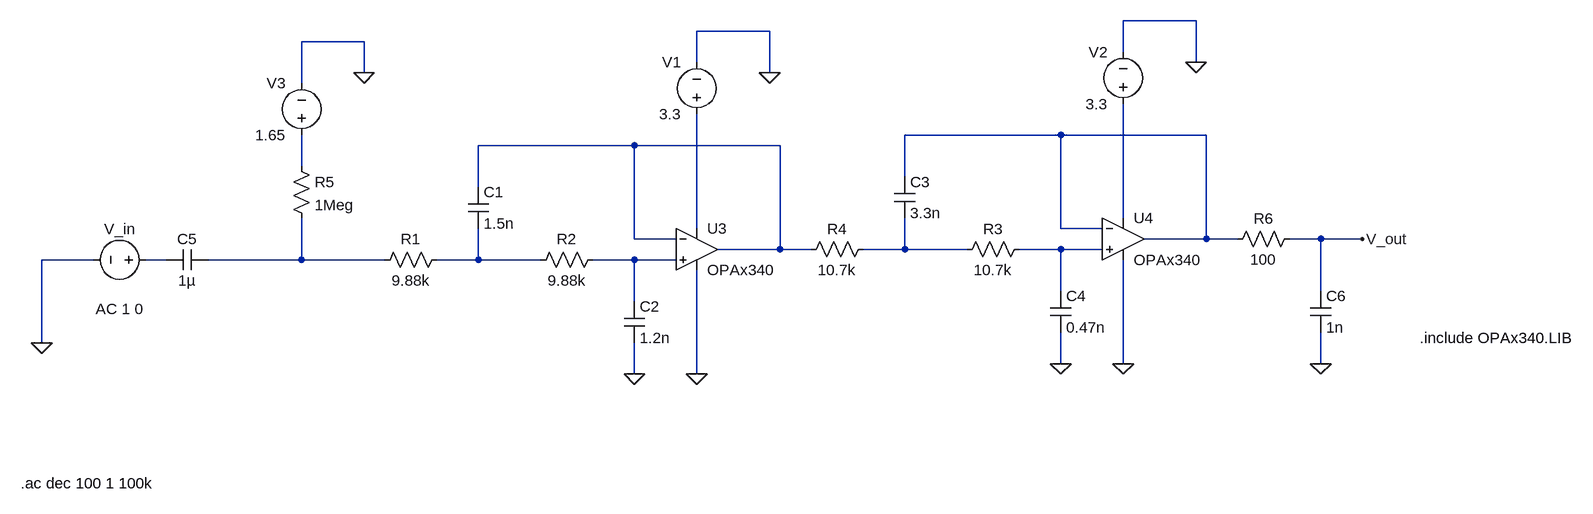
[diagram p0: schematic Analog_Input.asc]
Analog_Input.asc, the LTspice schematic file:
Version 4.1
SHEET 1 1376 680
WIRE 672 -192 560 -192
WIRE 16 -176 -96 -176
WIRE -608 -160 -704 -160
WIRE 560 -144 560 -192
WIRE -96 -128 -96 -176
WIRE 672 -128 672 -192
WIRE -608 -112 -608 -160
WIRE 16 -112 16 -176
WIRE -704 -96 -704 -160
WIRE 464 -16 224 -16
WIRE 688 -16 464 -16
WIRE -192 0 -432 0
WIRE 32 0 -192 0
WIRE -704 32 -704 -16
WIRE 224 48 224 -16
WIRE -432 64 -432 0
WIRE 560 112 560 -64
WIRE -96 128 -96 -48
WIRE 464 128 464 -16
WIRE 528 128 464 128
WIRE -192 144 -192 0
WIRE -128 144 -192 144
WIRE 688 144 688 -16
WIRE 688 144 592 144
WIRE 736 144 688 144
WIRE 864 144 816 144
WIRE 928 144 864 144
WIRE 32 160 32 0
WIRE 32 160 -64 160
WIRE 80 160 32 160
WIRE 224 160 224 112
WIRE 224 160 160 160
WIRE 320 160 224 160
WIRE 464 160 400 160
WIRE 528 160 464 160
WIRE -1024 176 -1104 176
WIRE -912 176 -944 176
WIRE -704 176 -704 112
WIRE -704 176 -848 176
WIRE -576 176 -704 176
WIRE -432 176 -432 128
WIRE -432 176 -496 176
WIRE -336 176 -432 176
WIRE -192 176 -256 176
WIRE -128 176 -192 176
WIRE 464 224 464 160
WIRE 864 224 864 144
WIRE -192 240 -192 176
WIRE -1104 304 -1104 176
WIRE 464 336 464 288
WIRE 560 336 560 176
WIRE 864 336 864 288
WIRE -192 352 -192 304
WIRE -96 352 -96 192
FLAG -192 352 0
FLAG 928 144 V_out
FLAG -96 352 0
FLAG 16 -112 0
FLAG -1104 304 0
FLAG 464 336 0
FLAG 560 336 0
FLAG 672 -128 0
FLAG -608 -112 0
FLAG 864 336 0
SYMBOL voltage -928 176 R90
WINDOW 0 -32 56 VBottom 2
WINDOW 3 88 56 VTop 2
WINDOW 123 60 56 VTop 2
WINDOW 39 0 0 Left 0
SYMATTR InstName V_in
SYMATTR Value ""
SYMATTR Value2 AC 1 0
SYMBOL res -240 160 R90
WINDOW 0 0 56 VBottom 2
WINDOW 3 32 56 VTop 2
SYMATTR InstName R2
SYMATTR Value 9.88k
SYMBOL cap -448 64 R0
SYMATTR InstName C1
SYMATTR Value 1.5n
SYMBOL cap -208 240 R0
SYMATTR InstName C2
SYMATTR Value 1.2n
SYMBOL voltage -96 -32 R180
WINDOW 0 24 96 Left 2
WINDOW 3 24 16 Left 2
WINDOW 123 0 0 Left 0
WINDOW 39 0 0 Left 0
SYMATTR InstName V1
SYMATTR Value 3.3
SYMBOL res -480 160 R90
WINDOW 0 0 56 VBottom 2
WINDOW 3 32 56 VTop 2
SYMATTR InstName R1
SYMATTR Value 9.88k
SYMBOL res 416 144 R90
WINDOW 0 0 56 VBottom 2
WINDOW 3 32 56 VTop 2
SYMATTR InstName R3
SYMATTR Value 10.7k
SYMBOL cap 208 48 R0
SYMATTR InstName C3
SYMATTR Value 3.3n
SYMBOL cap 448 224 R0
SYMATTR InstName C4
SYMATTR Value 0.47n
SYMBOL voltage 560 -48 R180
WINDOW 0 24 96 Left 2
WINDOW 3 24 16 Left 2
WINDOW 123 0 0 Left 0
WINDOW 39 0 0 Left 0
SYMATTR InstName V2
SYMATTR Value 3.3
SYMBOL res 176 144 R90
WINDOW 0 0 56 VBottom 2
WINDOW 3 32 56 VTop 2
SYMATTR InstName R4
SYMATTR Value 10.7k
SYMBOL OpAmps\\opamp2 -96 96 R0
SYMATTR InstName U3
SYMATTR Value OPAx340
SYMBOL OpAmps\\opamp2 560 80 R0
SYMATTR InstName U4
SYMATTR Value OPAx340
SYMBOL cap -848 160 R90
WINDOW 0 0 32 VBottom 2
WINDOW 3 32 32 VTop 2
SYMATTR InstName C5
SYMATTR Value 1µ
SYMBOL res -720 16 R0
SYMATTR InstName R5
SYMATTR Value 1Meg
SYMBOL voltage -704 0 R180
WINDOW 0 24 96 Left 2
WINDOW 3 24 16 Left 2
WINDOW 123 0 0 Left 0
WINDOW 39 0 0 Left 0
SYMATTR InstName V3
SYMATTR Value 1.65
SYMBOL res 832 128 R90
WINDOW 0 0 56 VBottom 2
WINDOW 3 32 56 VTop 2
SYMATTR InstName R6
SYMATTR Value 100
SYMBOL cap 848 224 R0
SYMATTR InstName C6
SYMATTR Value 1n
TEXT -1136 520 Left 2 !.ac dec 100 1 100k
TEXT 1016 296 Left 2 !.include OPAx340.LIB

The netlist it stands for:
* Analog_Input.asc
V_in N008 0 AC 1 0
R2 N011 N010 9.88k
C1 N002 N010 1.5n
C2 N011 0 1.2n
V1 N005 0 3.3
R1 N010 N009 9.88k
R3 N007 N006 10.7k
C3 N001 N006 3.3n
C4 N007 0 0.47n
V2 N004 0 3.3
R4 N006 N002 10.7k
X§U3 N011 N002 N005 0 N002 OPAx340  ; pins In+ In- V+ V- OUT
X§U4 N007 N001 N004 0 N001 OPAx340  ; pins In+ In- V+ V- OUT
C5 N009 N008 1µ
R5 N003 N009 1Meg
V3 N003 0 1.65
R6 V_out N001 100
C6 V_out 0 1n
.ac dec 100 1 100k
.include OPAx340.LIB
.backanno
.end